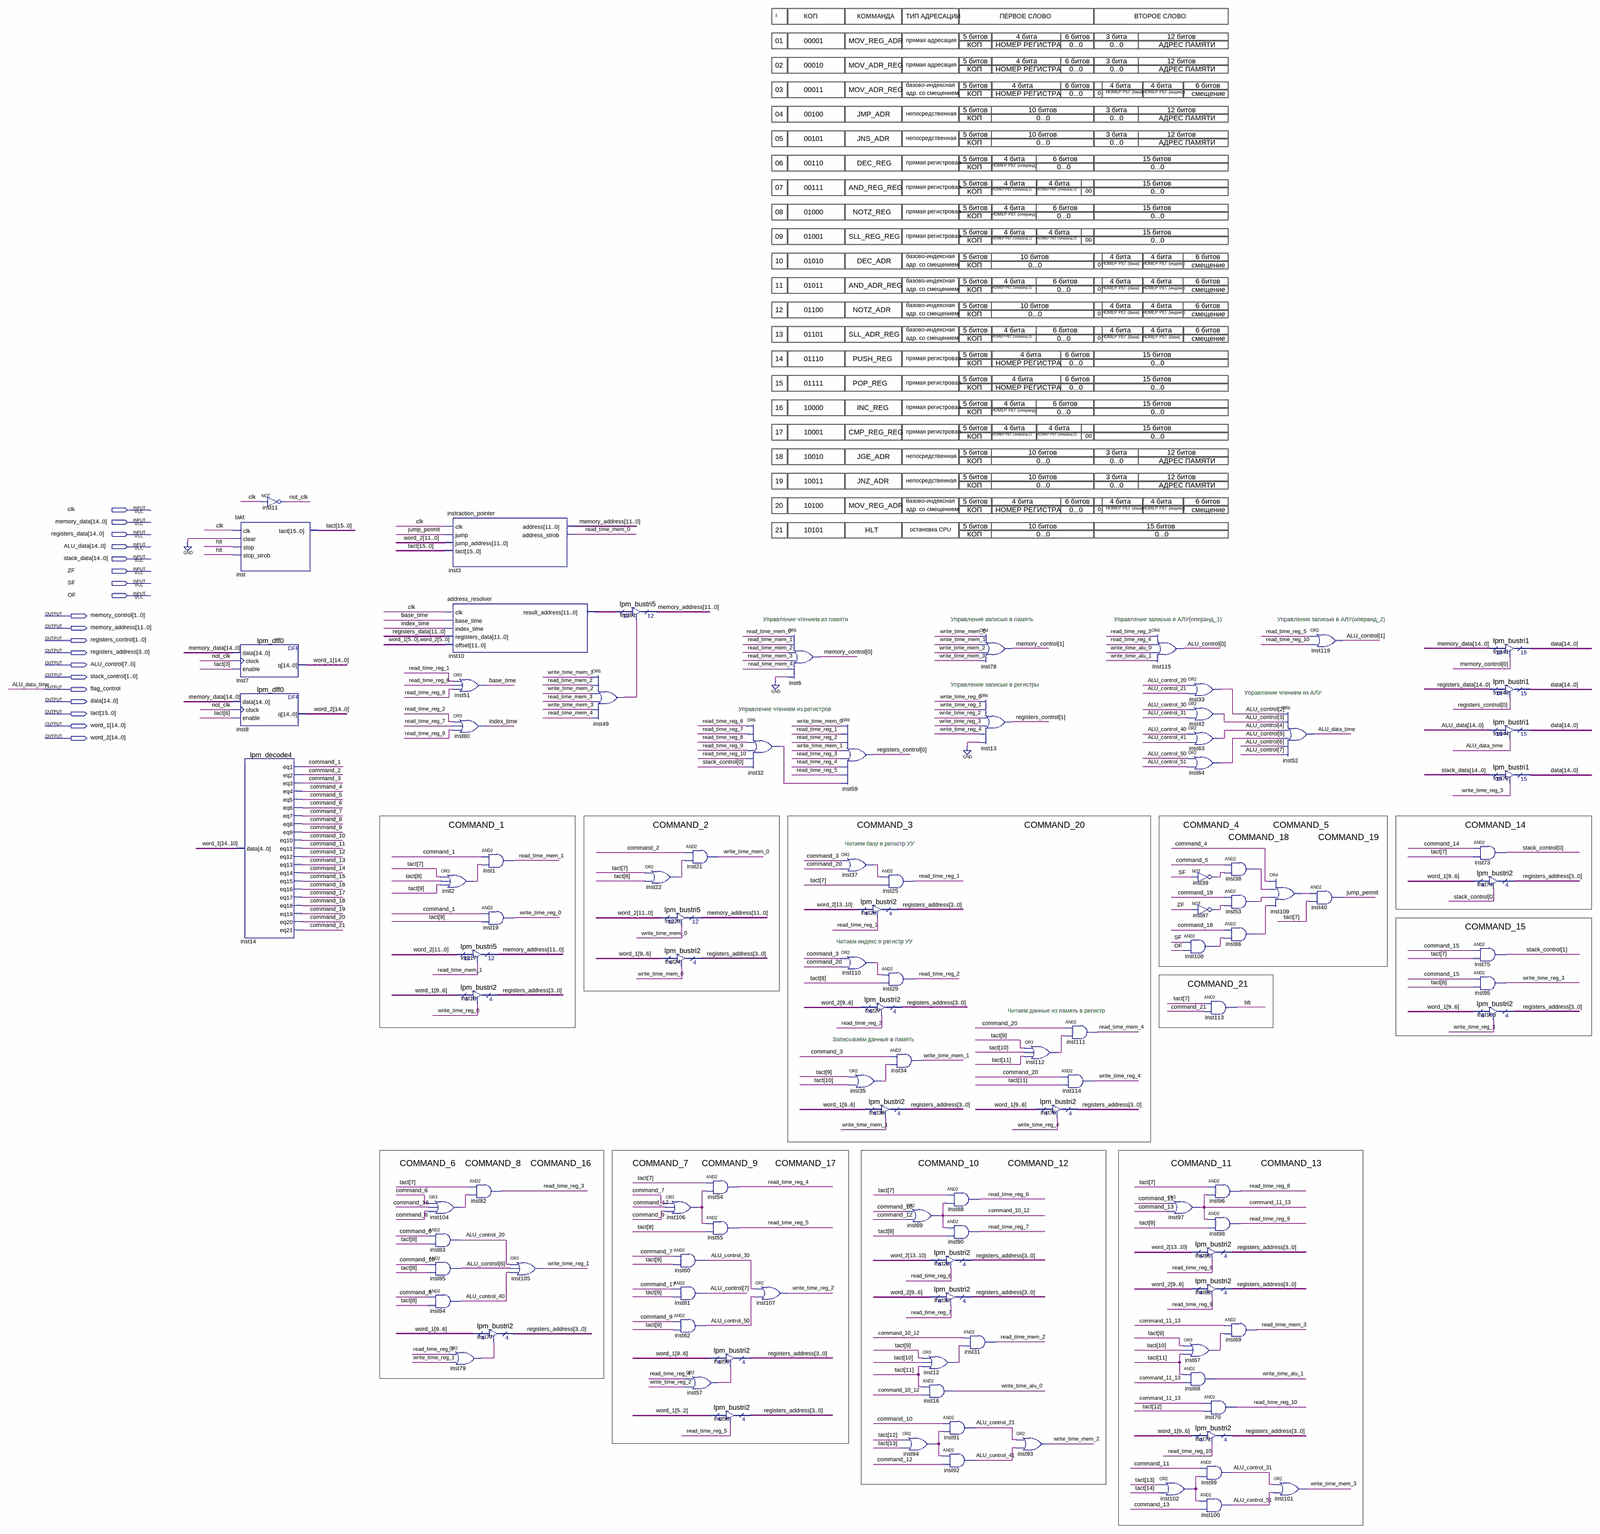
[diagram p0: schematic sheet, whole]
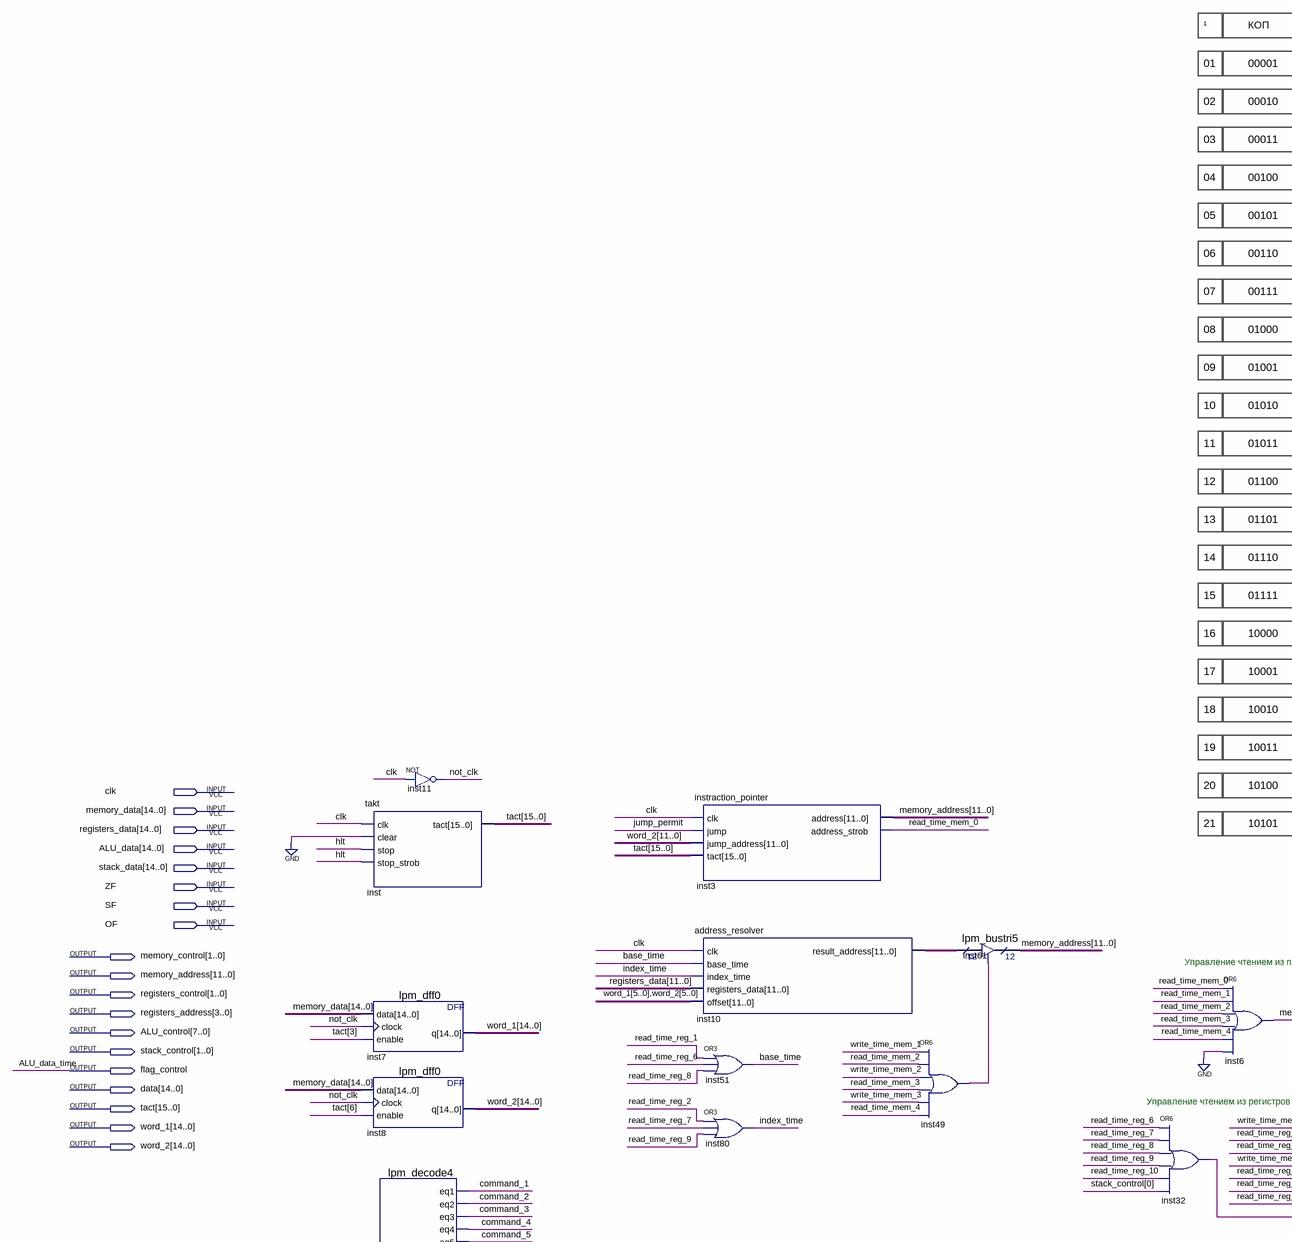
[diagram p1: schematic sheet, upper left part]
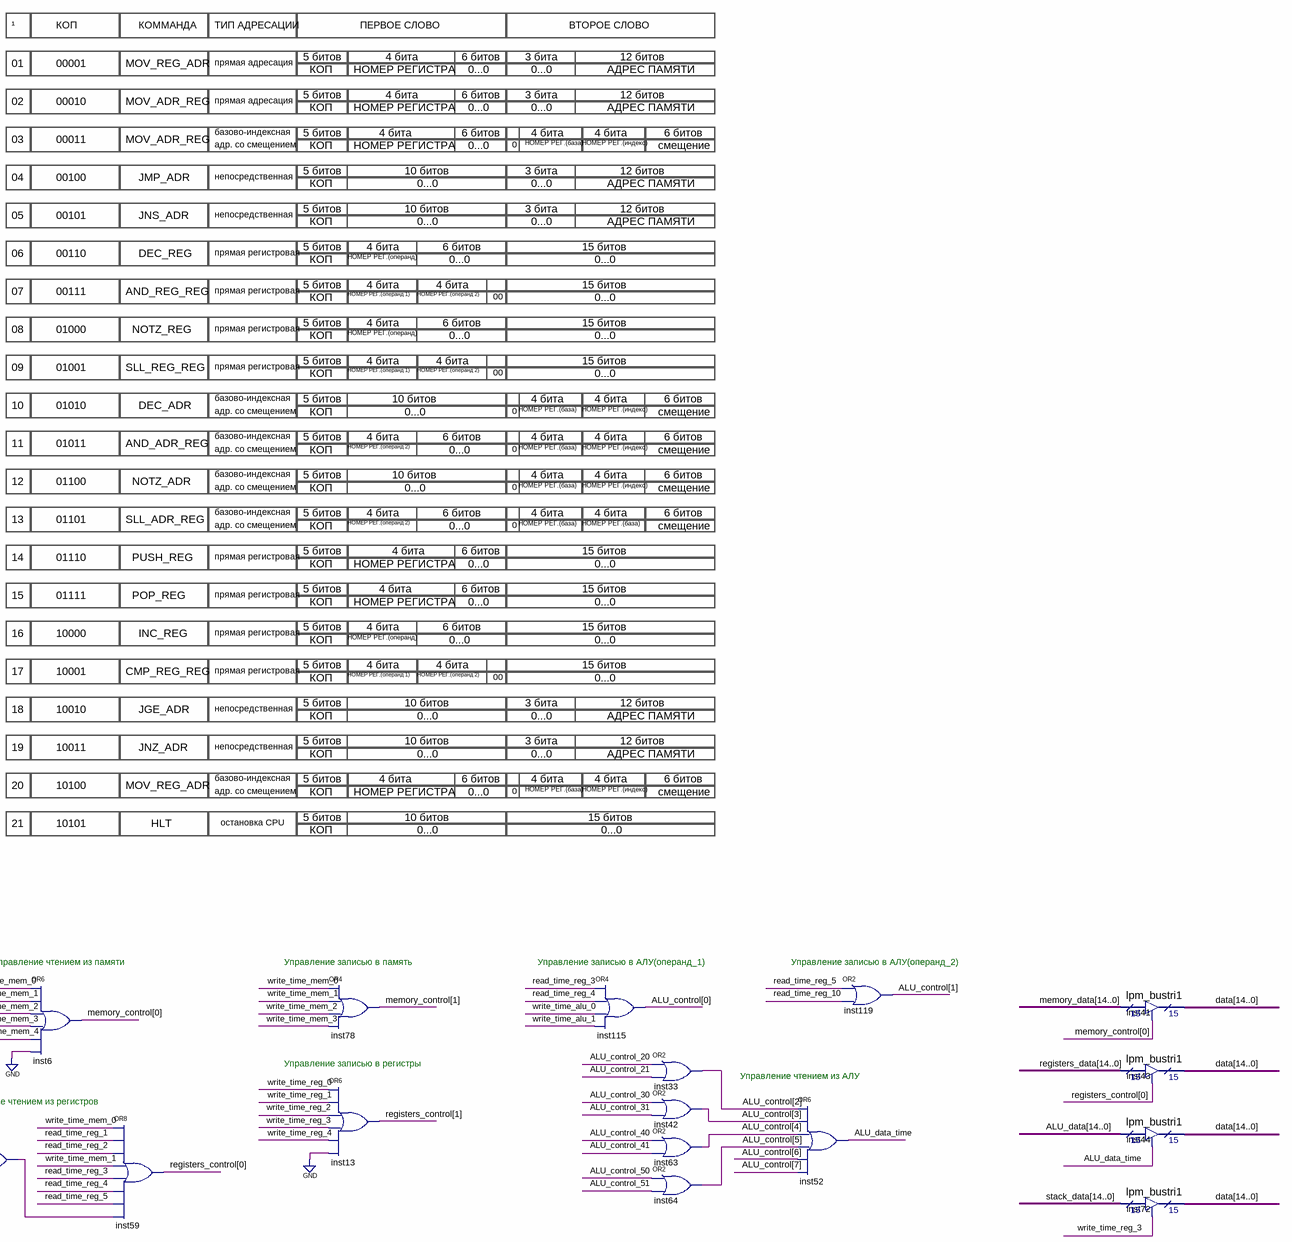
[diagram p2: schematic sheet, upper right part]
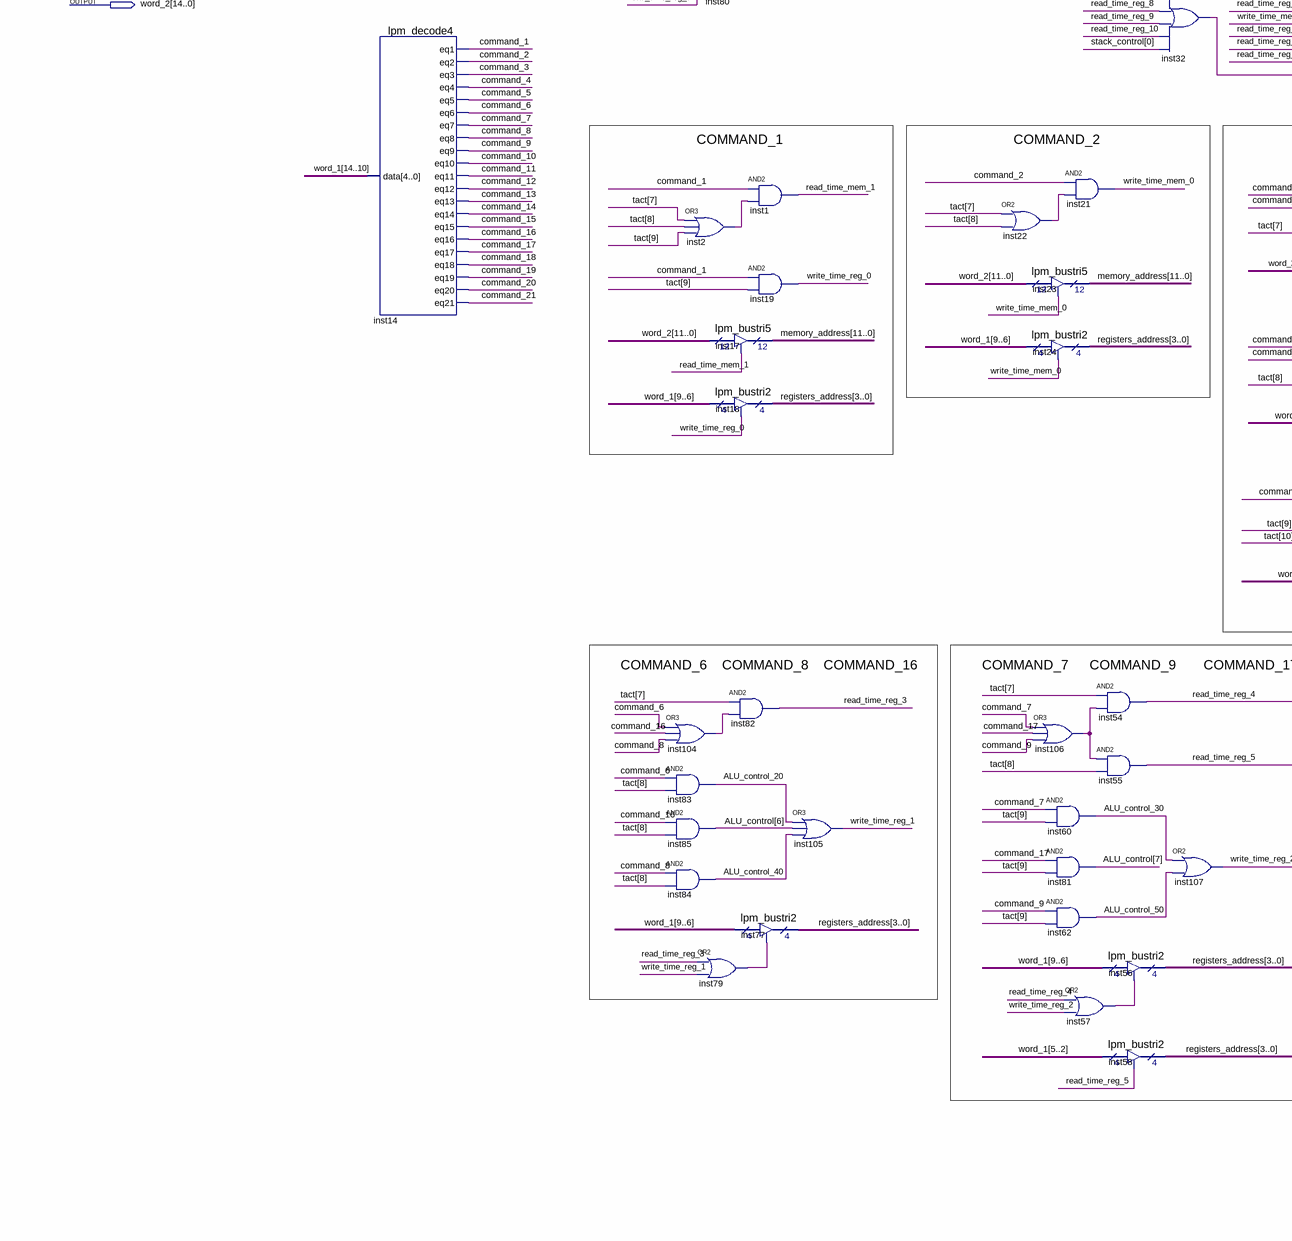
[diagram p3: schematic sheet, lower left part]
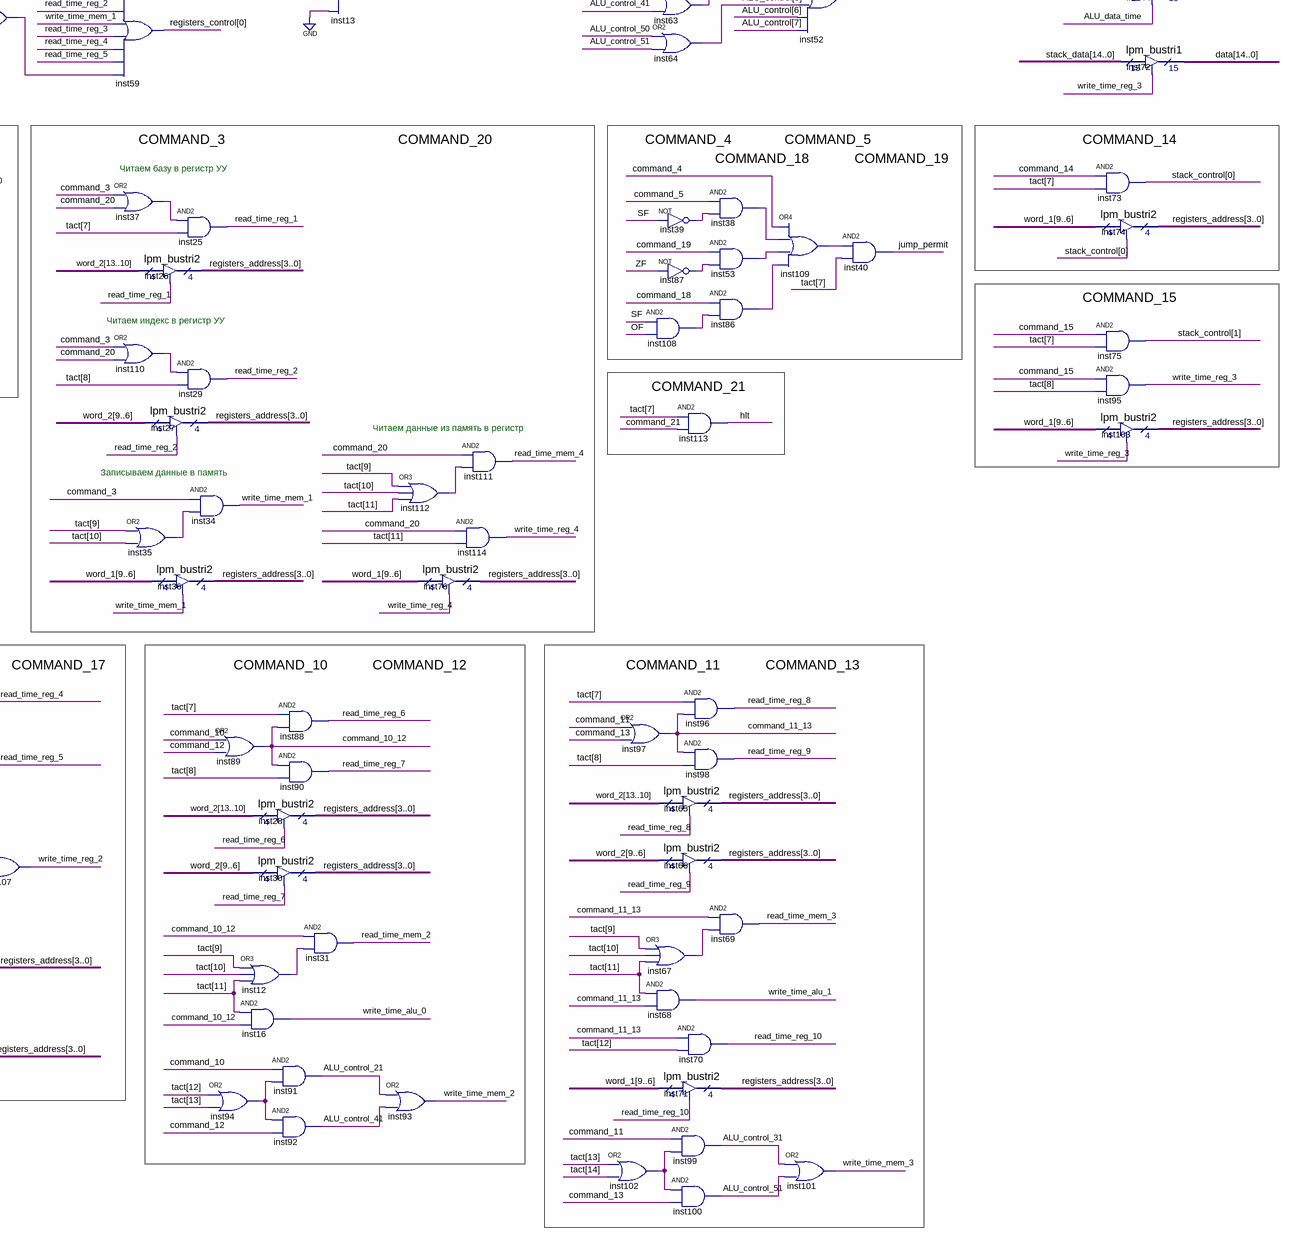
[diagram p4: schematic sheet, lower right part]
// Quartus schematic control_block.bdf as structural Verilog: 107 symbols, 19 pins
module control_block (
  input  clk,
  input  [14:0] memory_data,
  input  [14:0] registers_data,
  input  [14:0] ALU_data,
  input  [14:0] stack_data,
  input  ZF,
  input  SF,
  input  OF,
  output [1:0] memory_control,
  output [11:0] memory_address,
  output [1:0] registers_control,
  output [3:0] registers_address,
  output [7:0] ALU_control,
  output [1:0] stack_control,
  output flag_control,
  output [14:0] data,
  output [15:0] tact,
  output [14:0] word_1,
  output [14:0] word_2
);

  wire ALU_control_20, ALU_control_21, ALU_control_30, ALU_control_31, ALU_control_40, ALU_control_41,
       ALU_control_50, ALU_control_51, base_time, command_1, command_2, command_3, command_4, command_5,
       command_6, command_7, command_8, command_9, command_10, command_10_12, command_11, command_11_13,
       command_12, command_13, command_14, command_15, command_16, command_17, command_18, command_19,
       command_20, command_21, hlt, index_time, inst2_out, inst12_out, inst22_out, inst32_out, inst35_out,
       inst37_out, inst38_out, inst39_out, inst49_out, inst53_out, inst57_out, inst67_out, inst79_out,
       inst86_out, inst87_out, inst94_out, inst102_out, inst104_out, inst106_out, inst108_out, inst109_out,
       inst110_out, inst112_out, jump_permit, not_clk, read_time_mem_0, read_time_mem_1, read_time_mem_2,
       read_time_mem_3, read_time_mem_4, read_time_reg_1, read_time_reg_2, read_time_reg_3, read_time_reg_4,
       read_time_reg_5, read_time_reg_6, read_time_reg_7, read_time_reg_8, read_time_reg_9, read_time_reg_10,
       write_time_alu_0, write_time_alu_1, write_time_mem_0, write_time_mem_1, write_time_mem_2,
       write_time_mem_3, write_time_reg_0, write_time_reg_1, write_time_reg_2, write_time_reg_3,
       write_time_reg_4;
  wire [11:0] inst10_result_address;

  takt inst (.clk(clk), .clear(1'b0), .stop(hlt), .stop_strob(hlt), .tact(tact));
  lpm_dff0 inst7 (.data(memory_data), .clock(not_clk), .enable(tact[3]), .q(word_1));
  lpm_dff0 inst8 (.data(memory_data), .clock(not_clk), .enable(tact[6]), .q(word_2));
  lpm_decode4 inst14 (
    .data(word_1[14:10]), .eq1(command_1), .eq2(command_2), .eq3(command_3), .eq4(command_4),
    .eq5(command_5), .eq6(command_6), .eq7(command_7), .eq8(command_8), .eq9(command_9), .eq10(command_10),
    .eq11(command_11), .eq12(command_12), .eq13(command_13), .eq14(command_14), .eq15(command_15),
    .eq16(command_16), .eq17(command_17), .eq18(command_18), .eq19(command_19), .eq20(command_20),
    .eq21(command_21));
  not inst11 (not_clk, clk);
  instraction_pointer inst3 (
    .clk(clk), .jump(jump_permit), .jump_address(word_2[11:0]), .tact(tact), .address(memory_address),
    .address_strob(read_time_mem_0));
  address_resolver inst10 (
    .clk(clk), .base_time(base_time), .index_time(index_time), .registers_data(registers_data[11:0]),
    .offset({word_1[5:0], word_2[5:0]}), .result_address(inst10_result_address));
  or inst51 (base_time, read_time_reg_1, read_time_reg_6, read_time_reg_8);
  or inst80 (index_time, read_time_reg_2, read_time_reg_7, read_time_reg_9);
  or inst2 (inst2_out, tact[7], tact[8], tact[9]);
  or inst104 (inst104_out, command_6, command_16, command_8);
  and inst83 (ALU_control_20, command_6, tact[8]);
  and inst85 (ALU_control[6], command_16, tact[8]);
  and inst84 (ALU_control_40, command_8, tact[8]);
  or inst79 (inst79_out, read_time_reg_3, write_time_reg_1);
  and inst1 (read_time_mem_1, command_1, inst2_out);
  and inst19 (write_time_reg_0, command_1, tact[9]);
  lpm_bustri5 inst17 (.enabledt(read_time_mem_1), .data(word_2[11:0]), .tridata(memory_address));
  lpm_bustri2 inst18 (.enabledt(write_time_reg_0), .data(word_1[9:6]), .tridata(registers_address));
  and inst82 (read_time_reg_3, tact[7], inst104_out);
  lpm_bustri2 inst77 (.enabledt(inst79_out), .data(word_1[9:6]), .tridata(registers_address));
  or inst105 (write_time_reg_1, ALU_control_20, ALU_control[6], ALU_control_40);
  lpm_bustri5 inst61 (.enabledt(inst49_out), .data(inst10_result_address), .tridata(memory_address));
  or inst49 (inst49_out, write_time_mem_1, read_time_mem_2, write_time_mem_2, read_time_mem_3, write_time_mem_3, read_time_mem_4);
  or inst22 (inst22_out, tact[7], tact[8]);
  lpm_bustri5 inst23 (.enabledt(write_time_mem_0), .data(word_2[11:0]), .tridata(memory_address));
  lpm_bustri2 inst24 (.enabledt(write_time_mem_0), .data(word_1[9:6]), .tridata(registers_address));
  or inst106 (inst106_out, command_7, command_17, command_9);
  and inst60 (ALU_control_30, command_7, tact[9]);
  and inst81 (ALU_control[7], command_17, tact[9]);
  and inst62 (ALU_control_50, command_9, tact[9]);
  and inst21 (write_time_mem_0, command_2, inst22_out);
  and inst54 (read_time_reg_4, tact[7], inst106_out);
  and inst55 (read_time_reg_5, inst106_out, tact[8]);
  lpm_bustri2 inst56 (.enabledt(inst57_out), .data(word_1[9:6]), .tridata(registers_address));
  or inst57 (inst57_out, read_time_reg_4, write_time_reg_2);
  lpm_bustri2 inst58 (.enabledt(read_time_reg_5), .data(word_1[5:2]), .tridata(registers_address));
  or inst32 (inst32_out, read_time_reg_6, read_time_reg_7, read_time_reg_8, read_time_reg_9, read_time_reg_10, stack_control[0]);
  or inst107 (write_time_reg_2, ALU_control_30, ALU_control_50);
  or inst6 (memory_control[0], read_time_mem_0, read_time_mem_1, read_time_mem_2, read_time_mem_3, read_time_mem_4, 1'b0);
  or inst59 (registers_control[0], write_time_mem_0, read_time_reg_1, read_time_reg_2, write_time_mem_1, read_time_reg_3, read_time_reg_4, read_time_reg_5, inst32_out);
  or inst37 (inst37_out, command_3, command_20);
  or inst110 (inst110_out, command_3, command_20);
  lpm_bustri2 inst26 (.enabledt(read_time_reg_1), .data(word_2[13:10]), .tridata(registers_address));
  lpm_bustri2 inst27 (.enabledt(read_time_reg_2), .data(word_2[9:6]), .tridata(registers_address));
  or inst35 (inst35_out, tact[9], tact[10]);
  lpm_bustri2 inst36 (.enabledt(write_time_mem_1), .data(word_1[9:6]), .tridata(registers_address));
  and inst25 (read_time_reg_1, inst37_out, tact[7]);
  and inst29 (read_time_reg_2, inst110_out, tact[8]);
  and inst34 (write_time_mem_1, command_3, inst35_out);
  or inst89 (command_10_12, command_10, command_12);
  or inst94 (inst94_out, tact[12], tact[13]);
  lpm_bustri2 inst28 (.enabledt(read_time_reg_6), .data(word_2[13:10]), .tridata(registers_address));
  lpm_bustri2 inst30 (.enabledt(read_time_reg_7), .data(word_2[9:6]), .tridata(registers_address));
  or inst12 (inst12_out, tact[9], tact[10], tact[11]);
  and inst16 (write_time_alu_0, tact[11], command_10_12);
  and inst91 (ALU_control_21, command_10, inst94_out);
  and inst92 (ALU_control_41, inst94_out, command_12);
  and inst88 (read_time_reg_6, tact[7], command_10_12);
  and inst90 (read_time_reg_7, command_10_12, tact[8]);
  and inst31 (read_time_mem_2, command_10_12, inst12_out);
  or inst78 (memory_control[1], write_time_mem_0, write_time_mem_1, write_time_mem_2, write_time_mem_3);
  or inst13 (registers_control[1], write_time_reg_0, write_time_reg_1, write_time_reg_2, write_time_reg_3, write_time_reg_4, 1'b0);
  or inst112 (inst112_out, tact[9], tact[10], tact[11]);
  lpm_bustri2 inst76 (.enabledt(write_time_reg_4), .data(word_1[9:6]), .tridata(registers_address));
  or inst93 (write_time_mem_2, ALU_control_21, ALU_control_41);
  and inst111 (read_time_mem_4, command_20, inst112_out);
  and inst114 (write_time_reg_4, command_20, tact[11]);
  or inst115 (ALU_control[0], read_time_reg_3, read_time_reg_4, write_time_alu_0, write_time_alu_1);
  or inst97 (command_11_13, command_11, command_13);
  or inst102 (inst102_out, tact[13], tact[14]);
  or inst33 (ALU_control[2], ALU_control_20, ALU_control_21);
  or inst42 (ALU_control[3], ALU_control_30, ALU_control_31);
  or inst63 (ALU_control[4], ALU_control_40, ALU_control_41);
  or inst64 (ALU_control[5], ALU_control_50, ALU_control_51);
  not inst39 (inst39_out, SF);
  not inst87 (inst87_out, ZF);
  and inst108 (inst108_out, SF, OF);
  and inst113 (hlt, tact[7], command_21);
  lpm_bustri2 inst65 (.enabledt(read_time_reg_8), .data(word_2[13:10]), .tridata(registers_address));
  lpm_bustri2 inst66 (.enabledt(read_time_reg_9), .data(word_2[9:6]), .tridata(registers_address));
  or inst67 (inst67_out, tact[9], tact[10], tact[11]);
  and inst68 (write_time_alu_1, tact[11], command_11_13);
  and inst70 (read_time_reg_10, command_11_13, tact[12]);
  lpm_bustri2 inst71 (.enabledt(read_time_reg_10), .data(word_1[9:6]), .tridata(registers_address));
  and inst99 (ALU_control_31, command_11, inst102_out);
  and inst100 (ALU_control_51, inst102_out, command_13);
  and inst38 (inst38_out, command_5, inst39_out);
  and inst53 (inst53_out, command_19, inst87_out);
  and inst86 (inst86_out, command_18, inst108_out);
  and inst96 (read_time_reg_8, tact[7], command_11_13);
  and inst98 (read_time_reg_9, command_11_13, tact[8]);
  and inst69 (read_time_mem_3, command_11_13, inst67_out);
  or inst109 (inst109_out, command_4, inst38_out, inst53_out, inst86_out);
  or inst52 (flag_control, ALU_control[2], ALU_control[3], ALU_control[4], ALU_control[5], ALU_control[6], ALU_control[7]);
  or inst101 (write_time_mem_3, ALU_control_31, ALU_control_51);
  or inst119 (ALU_control[1], read_time_reg_5, read_time_reg_10);
  and inst40 (jump_permit, inst109_out, tact[7]);
  lpm_bustri1 inst41 (.enabledt(memory_control[0]), .data(memory_data), .tridata(data));
  lpm_bustri1 inst43 (.enabledt(registers_control[0]), .data(registers_data), .tridata(data));
  lpm_bustri1 inst44 (.enabledt(flag_control), .data(ALU_data), .tridata(data));
  lpm_bustri1 inst72 (.enabledt(write_time_reg_3), .data(stack_data), .tridata(data));
  and inst73 (stack_control[0], command_14, tact[7]);
  lpm_bustri2 inst74 (.enabledt(stack_control[0]), .data(word_1[9:6]), .tridata(registers_address));
  and inst75 (stack_control[1], command_15, tact[7]);
  and inst95 (write_time_reg_3, command_15, tact[8]);
  lpm_bustri2 inst103 (.enabledt(write_time_reg_3), .data(word_1[9:6]), .tridata(registers_address));

  // Other names for the same wires on the sheet: ALU_data_time = flag_control

  // Notes on the sheet:
  //   ¹
  //   КОП
  //   КОММАНДА
  //   ТИП АДРЕСАЦИИ
  //   ПЕРВОЕ СЛОВО
  //   ВТОРОЕ СЛОВО
  //   5 битов
  //   4 бита
  //   6 битов
  //   3 бита
  //   12 битов
  //   01
  //   00001
  //   MOV_REG_ADR
  //   прямая адресация
  //   КОП
  //   НОМЕР РЕГИСТРА
  //   0...0
  //   0...0
  //   АДРЕС ПАМЯТИ
  //   5 битов
  //   4 бита
  //   6 битов
  //   3 бита
  //   12 битов
  //   02
  //   00010
  //   MOV_ADR_REG
  //   прямая адресация
  //   КОП
  //   НОМЕР РЕГИСТРА
  //   0...0
  //   0...0
  //   АДРЕС ПАМЯТИ
  //   базово-индексная
  //   5 битов
  //   4 бита
  //   6 битов
  //   4 бита
  //   4 бита
  //   6 битов
  //   03
  //   00011
  //   MOV_ADR_REG
  //   адр. со смещением
  //   КОП
  //   НОМЕР РЕГИСТРА
  //   0...0
  //   0
  //   НОМЕР РЕГ.(база)
  //   НОМЕР РЕГ.(индекс)
  //   смещение
  //   5 битов
  //   10 битов
  //   3 бита
  //   12 битов
  //   04
  //   00100
  //   JMP_ADR
  //   непосредственная
  //   КОП
  //   0...0
  //   0...0
  //   АДРЕС ПАМЯТИ
  //   5 битов
  //   10 битов
  //   3 бита
  //   12 битов
  //   05
  //   00101
  //   JNS_ADR
  //   непосредственная
  //   КОП
  //   0...0
  //   0...0
  //   АДРЕС ПАМЯТИ
  //   5 битов
  //   4 бита
  //   6 битов
  //   15 битов
  //   06
  //   00110
  //   DEC_REG
  //   прямая регистровая
  //   КОП
  //   НОМЕР РЕГ.(операнд)
  //   0...0
  //   0...0
  //   5 битов
  //   4 бита
  //   4 бита
  //   15 битов
  //   07
  //   00111
  //   AND_REG_REG
  //   прямая регистровая
  //   КОП
  //   НОМЕР РЕГ.(операнд 1)
  //   НОМЕР РЕГ.(операнд 2)
  //   00
  //   0...0
  //   5 битов
  //   4 бита
  //   6 битов
  //   15 битов
  //   08
  //   01000
  //   NOTZ_REG
  //   прямая регистровая
  //   КОП
  //   НОМЕР РЕГ.(операнд)
  //   0...0
  //   0...0
  //   5 битов
  //   4 бита
  //   4 бита
  //   15 битов
  //   09
  //   01001
  //   SLL_REG_REG
  //   прямая регистровая
  //   КОП
  //   НОМЕР РЕГ.(операнд 1)
  //   НОМЕР РЕГ.(операнд 2)
  //   00
  //   0...0
  //   базово-индексная
  //   5 битов
  //   10 битов
  //   4 бита
  //   4 бита
  //   6 битов
  //   10
  //   01010
  //   DEC_ADR
  //   адр. со смещением
  //   КОП
  //   0...0
  //   0
  //   НОМЕР РЕГ.(база)
  //   НОМЕР РЕГ.(индекс)
  //   смещение
  //   базово-индексная
  //   5 битов
  //   4 бита
  //   6 битов
  //   4 бита
  //   4 бита
  //   6 битов
  //   11
  //   01011
  //   AND_ADR_REG
  //   адр. со смещением
  //   КОП
  //   НОМЕР РЕГ.(операнд 2)
  //   0...0
  //   0
  //   НОМЕР РЕГ.(база)
  //   НОМЕР РЕГ.(индекс)
  //   смещение
  //   базово-индексная
  //   5 битов
  //   10 битов
  //   4 бита
  //   4 бита
  //   6 битов
  //   12
  //   01100
  //   NOTZ_ADR
  //   адр. со смещением
  //   КОП
  //   0...0
  //   0
  //   НОМЕР РЕГ.(база)
  //   НОМЕР РЕГ.(индекс)
  //   смещение
  //   базово-индексная
  //   5 битов
  //   4 бита
  //   6 битов
  //   4 бита
  //   4 бита
  //   6 битов
  //   13
  //   01101
  //   SLL_ADR_REG
  //   адр. со смещением
  //   КОП
  //   НОМЕР РЕГ.(операнд 2)
  //   0...0
  //   0
  //   НОМЕР РЕГ.(база)
  //   НОМЕР РЕГ.(база)
  //   смещение
  //   5 битов
  //   4 бита
  //   6 битов
  //   15 битов
  //   14
  //   01110
  //   PUSH_REG
  //   прямая регистровая
  //   КОП
  //   НОМЕР РЕГИСТРА
  //   0...0
  //   0...0
  //   5 битов
  //   4 бита
  //   6 битов
  //   15 битов
  //   15
  //   01111
  //   POP_REG
  //   прямая регистровая
  //   КОП
  //   НОМЕР РЕГИСТРА
  //   0...0
  //   0...0
  //   5 битов
  //   4 бита
  //   6 битов
  //   15 битов
  //   16
  //   10000
  //   INC_REG
  //   прямая регистровая
  //   КОП
  //   НОМЕР РЕГ.(операнд)
  //   0...0
  //   0...0
  //   5 битов
  //   4 бита
  //   4 бита
  //   15 битов
  //   17
  //   10001
  //   CMP_REG_REG
  //   прямая регистровая
  //   КОП
  //   НОМЕР РЕГ.(операнд 1)
  //   НОМЕР РЕГ.(операнд 2)
  //   00
  //   0...0
  //   5 битов
  //   10 битов
  //   3 бита
  //   12 битов
  //   18
  //   10010
  //   JGE_ADR
  //   непосредственная
  //   КОП
  //   0...0
  //   0...0
  //   АДРЕС ПАМЯТИ
  //   5 битов
  //   10 битов
  //   3 бита
  //   12 битов
  //   19
  //   10011
  //   JNZ_ADR
  //   непосредственная
  //   КОП
  //   0...0
  //   0...0
  //   АДРЕС ПАМЯТИ
  //   базово-индексная
  //   5 битов
  //   4 бита
  //   6 битов
  //   4 бита
  //   4 бита
  //   6 битов
  //   20
  //   10100
  //   MOV_REG_ADR
  //   адр. со смещением
  //   КОП
  //   НОМЕР РЕГИСТРА
  //   0...0
  //   0
  //   НОМЕР РЕГ.(база)
  //   НОМЕР РЕГ.(индекс)
  //   смещение
  //   5 битов
  //   10 битов
  //   15 битов
  //   21
  //   10101
  //   HLT
  //   остановка CPU
  //   КОП
  //   0...0
  //   0...0
  //   Управление чтением из памяти
  //   Управление записью в память
  //   Управление записью в АЛУ(операнд_1)
  //   Управление записью в АЛУ(операнд_2)
  //   Управление записью в регистры
  //   Управление чтением из АЛУ
  //   Управление чтением из регистров
  //   COMMAND_1
  //   COMMAND_2
  //   COMMAND_3
  //   COMMAND_20
  //   COMMAND_4
  //   COMMAND_5
  //   COMMAND_14
  //   COMMAND_18
  //   COMMAND_19
  //   Читаем базу в регистр УУ
  //   COMMAND_15
  //   Читаем индекс в регистр УУ
  //   COMMAND_21
  //   Читаем данные из память в регистр
  //   Записываем данные в память
  //   COMMAND_6
  //   COMMAND_8
  //   COMMAND_16
  //   COMMAND_7
  //   COMMAND_9
  //   COMMAND_17
  //   COMMAND_10
  //   COMMAND_12
  //   COMMAND_11
  //   COMMAND_13
endmodule
